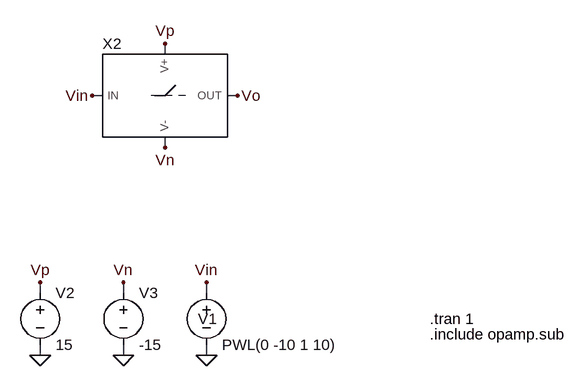
[diagram p0: schematic relu_test.asc]
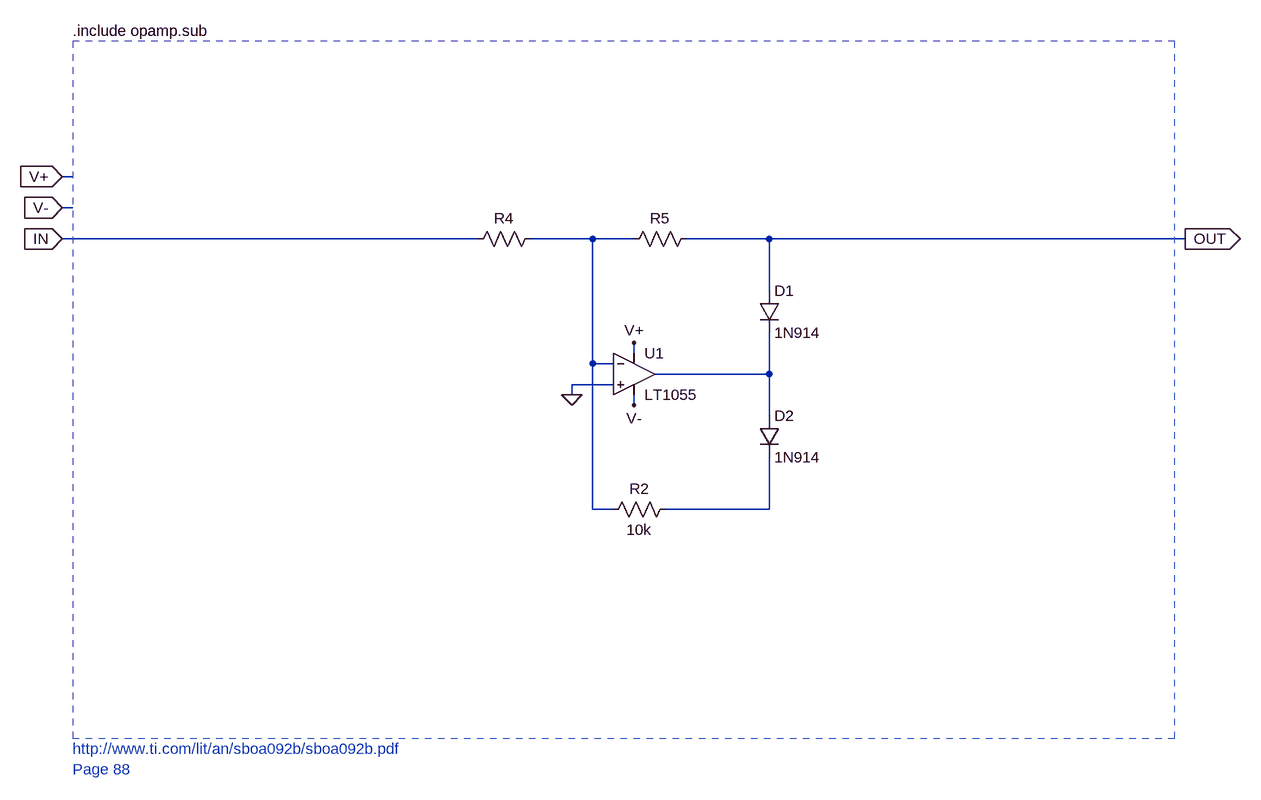
[diagram p1: sub-circuit relu.asc]
relu_test.asc, the LTspice schematic file:
Version 4
SHEET 1 880 680
WIRE 112 -16 112 -32
WIRE 16 48 0 48
WIRE 224 48 208 48
WIRE 112 128 112 112
WIRE -80 352 -80 336
WIRE 48 352 48 336
WIRE 176 352 176 336
WIRE -80 448 -80 432
WIRE 48 448 48 432
WIRE 176 448 176 432
FLAG 176 448 0
FLAG -80 448 0
FLAG 48 448 0
FLAG -80 336 Vp
FLAG 48 336 Vn
FLAG 112 -32 Vp
FLAG 112 128 Vn
FLAG 224 48 Vo
FLAG 176 336 Vin
FLAG 0 48 Vin
SYMBOL voltage 176 336 R0
WINDOW 0 -13 56 Left 2
WINDOW 123 0 0 Left 0
WINDOW 39 0 0 Left 0
SYMATTR InstName V1
SYMATTR Value PWL(0 -10 1 10)
SYMBOL voltage -80 336 R0
WINDOW 123 0 0 Left 0
WINDOW 39 0 0 Left 0
SYMATTR InstName V2
SYMATTR Value 15
SYMBOL voltage 48 336 R0
WINDOW 123 0 0 Left 0
WINDOW 39 0 0 Left 0
SYMATTR InstName V3
SYMATTR Value -15
SYMBOL relu 112 48 R0
SYMATTR InstName X2
TEXT 520 416 Left 2 !.include opamp.sub
TEXT 520 392 Left 2 !.tran 1

relu.asc, the sub-circuit schematic file:
Version 4
SHEET 1 3332 1252
WIRE 1344 240 1328 240
WIRE 1344 288 1328 288
WIRE 1968 336 1328 336
WIRE 2144 336 2048 336
WIRE 2208 336 2144 336
WIRE 2416 336 2288 336
WIRE 3056 336 2416 336
WIRE 2416 416 2416 336
WIRE 2208 512 2208 496
WIRE 2144 528 2144 336
WIRE 2176 528 2144 528
WIRE 2416 544 2416 480
WIRE 2416 544 2240 544
WIRE 2176 560 2112 560
WIRE 2112 576 2112 560
WIRE 2208 592 2208 576
WIRE 2416 608 2416 544
WIRE 2144 752 2144 528
WIRE 2176 752 2144 752
WIRE 2416 752 2416 672
WIRE 2416 752 2256 752
FLAG 2208 496 V+
FLAG 2208 592 V-
FLAG 1328 336 IN
IOPIN 1328 336 In
FLAG 3056 336 OUT
IOPIN 3056 336 Out
FLAG 1328 240 V+
IOPIN 1328 240 In
FLAG 1328 288 V-
IOPIN 1328 288 In
FLAG 2112 576 0
SYMBOL res 1952 352 R270
WINDOW 0 32 56 VTop 2
WINDOW 3 0 56 Invisible 2
SYMATTR InstName R4
SYMATTR Value 10k
SYMBOL res 2304 320 R90
WINDOW 0 0 56 VBottom 2
WINDOW 3 32 56 Invisible 2
SYMATTR InstName R5
SYMATTR Value 10k
SYMBOL Opamps\\LT1055 2208 480 R0
SYMATTR InstName U1
SYMBOL res 2272 736 R90
WINDOW 0 0 56 VBottom 2
WINDOW 3 32 56 VTop 2
SYMATTR InstName R2
SYMATTR Value 10k
SYMBOL diode 2400 416 R0
SYMATTR InstName D1
SYMATTR Value 1N914
SYMBOL diode 2400 608 R0
SYMATTR InstName D2
SYMATTR Value 1N914
TEXT 1344 16 Left 2 !.include opamp.sub
TEXT 1344 1120 Left 2 ;http://www.ti.com/lit/an/sboa092b/sboa092b.pdf
TEXT 1344 1152 Left 2 ;Page 88
RECTANGLE Normal 3040 32 1344 1104 2

The netlist it stands for:
* relu_test.asc
V1 Vin 0 PWL(0 -10 1 10)
V2 Vp 0 15
V3 Vn 0 -15
XX2 Vin Vp Vn Vo relu

* block symbol definitions
.subckt relu IN V+ V- OUT
R4 IN N001 10k
R5 OUT N001 10k
XU1 0 N001 V+ V- N002 LT1055  ; pins In+ In- V+ V- OUT
R2 N003 N001 10k
D1 OUT N002 1N914
D2 N002 N003 1N914
.include opamp.sub
* http://www.ti.com/lit/an/sboa092b/sboa092b.pdf
* Page 88
.ends relu

.model D D
.lib standard.dio
.include opamp.sub
.tran 1
.backanno
.end